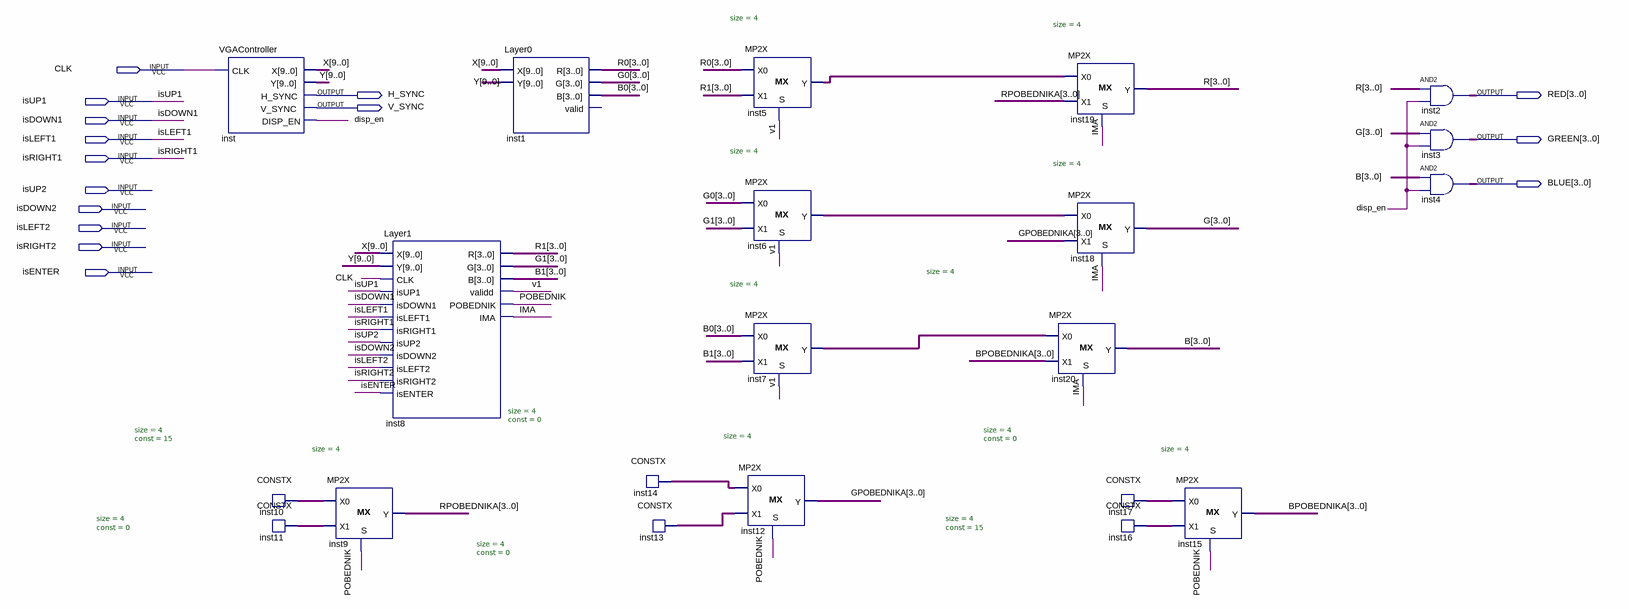
[diagram p0: schematic sheet]
// Quartus schematic Lab2Demo.bdf as structural Verilog: 21 symbols, 15 pins
module Lab2Demo (
  input  CLK,
  input  isUP1,
  input  isDOWN1,
  input  isLEFT1,
  input  isRIGHT1,
  input  isUP2,
  input  isDOWN2,
  input  isLEFT2,
  input  isRIGHT2,
  input  isENTER,
  output H_SYNC,
  output [3:0] RED,
  output V_SYNC,
  output [3:0] GREEN,
  output [3:0] BLUE
);

  wire disp_en, IMA, POBEDNIK, v1;
  wire [3:0] B, B0, B1, BPOBEDNIKA, G, G0, G1, GPOBEDNIKA, inst5_y, inst6_y, inst7_y, inst10_data,
       inst11_data, inst13_data, inst14_data, inst16_data, inst17_data, R, R0, R1, RPOBEDNIKA;
  wire [9:0] X, Y;

  VGAController inst (.CLK(CLK), .X(X), .Y(Y), .H_SYNC(H_SYNC), .V_SYNC(V_SYNC), .DISP_EN(disp_en));
  CONSTX #(.size(4), .\const (15)) inst10 (.data(inst10_data));
  CONSTX #(.size(4), .\const (0)) inst11 (.data(inst11_data));
  MP2X #(.size(4)) inst9 (.S(POBEDNIK), .X0(inst10_data), .X1(inst11_data), .Y(RPOBEDNIKA));
  Layer1 inst8 (
    .X(X), .Y(Y), .CLK(CLK), .isUP1(isUP1), .isDOWN1(isDOWN1), .isLEFT1(isLEFT1), .isRIGHT1(isRIGHT1),
    .isUP2(isUP2), .isDOWN2(isDOWN2), .isLEFT2(isLEFT2), .isRIGHT2(isRIGHT2), .isENTER(isENTER), .R(R1),
    .G(G1), .B(B1), .validd(v1), .POBEDNIK(POBEDNIK), .IMA(IMA));
  Layer0 inst1 (.X(X), .Y(Y), .R(R0), .G(G0), .B(B0));  // open: valid
  CONSTX #(.size(4), .\const (0)) inst14 (.data(inst14_data));
  CONSTX #(.size(4), .\const (0)) inst13 (.data(inst13_data));
  MP2X #(.size(4)) inst5 (.S(v1), .X0(R0), .X1(R1), .Y(inst5_y));
  MP2X #(.size(4)) inst6 (.S(v1), .X0(G0), .X1(G1), .Y(inst6_y));
  MP2X #(.size(4)) inst7 (.S(v1), .X0(B0), .X1(B1), .Y(inst7_y));
  MP2X #(.size(4)) inst12 (.S(POBEDNIK), .X0(inst14_data), .X1(inst13_data), .Y(GPOBEDNIKA));
  MP2X #(.size(4)) inst19 (.S(IMA), .X0(inst5_y), .X1(RPOBEDNIKA), .Y(R));
  MP2X #(.size(4)) inst18 (.S(IMA), .X0(inst6_y), .X1(GPOBEDNIKA), .Y(G));
  MP2X #(.size(4)) inst20 (.S(IMA), .X0(inst7_y), .X1(BPOBEDNIKA), .Y(B));
  CONSTX #(.size(4), .\const (0)) inst17 (.data(inst17_data));
  CONSTX #(.size(4), .\const (15)) inst16 (.data(inst16_data));
  MP2X #(.size(4)) inst15 (.S(POBEDNIK), .X0(inst17_data), .X1(inst16_data), .Y(BPOBEDNIKA));
  assign RED = R & {4{disp_en}};  // AND2 inst2, 4 bits wide
  assign GREEN = G & {4{disp_en}};  // AND2 inst3, 4 bits wide
  assign BLUE = B & {4{disp_en}};  // AND2 inst4, 4 bits wide
endmodule
